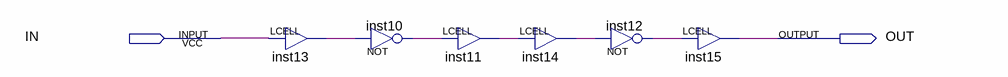
[diagram p0: schematic sheet]
// Quartus schematic pause.bdf as structural Verilog: 6 symbols, 2 pins
module pause (
  input  IN,
  output OUT
);

  wire inst10_out, inst11_out, inst12_out, inst13_out, inst14_out;

  LCELL inst13 (.IN(IN), .OUT(inst13_out));
  not inst10 (inst10_out, inst13_out);
  LCELL inst11 (.IN(inst10_out), .OUT(inst11_out));
  LCELL inst14 (.IN(inst11_out), .OUT(inst14_out));
  not inst12 (inst12_out, inst14_out);
  LCELL inst15 (.IN(inst12_out), .OUT(OUT));
endmodule
